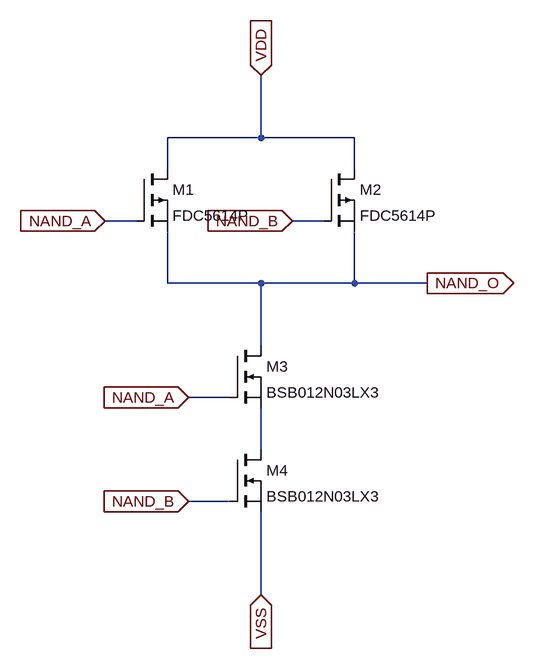
[diagram p0: schematic m_Nand.asc]
m_Nand.asc, the LTspice schematic file:
Version 4
SHEET 1 880 680
WIRE 192 -336 192 -432
WIRE 192 -336 48 -336
WIRE 336 -336 192 -336
WIRE 48 -288 48 -336
WIRE 336 -288 336 -336
WIRE 0 -208 -48 -208
WIRE 288 -208 240 -208
WIRE 48 -112 48 -192
WIRE 192 -112 48 -112
WIRE 336 -112 336 -192
WIRE 336 -112 192 -112
WIRE 448 -112 336 -112
WIRE 192 -16 192 -112
WIRE 144 64 80 64
WIRE 192 144 192 80
WIRE 144 224 80 224
WIRE 192 368 192 240
FLAG 192 -432 VDD
IOPIN 192 -432 In
FLAG 192 368 VSS
IOPIN 192 368 In
FLAG -48 -208 NAND_A
IOPIN -48 -208 In
FLAG 448 -112 NAND_O
IOPIN 448 -112 Out
FLAG 240 -208 NAND_B
IOPIN 240 -208 In
FLAG 80 64 NAND_A
IOPIN 80 64 In
FLAG 80 224 NAND_B
IOPIN 80 224 In
SYMBOL pmos 0 -288 R0
SYMATTR InstName M1
SYMATTR Value FDC5614P
SYMBOL pmos 288 -288 R0
SYMATTR InstName M2
SYMATTR Value FDC5614P
SYMBOL nmos 144 -16 R0
SYMATTR InstName M3
SYMATTR Value BSB012N03LX3
SYMBOL nmos 144 144 R0
SYMATTR InstName M4
SYMATTR Value BSB012N03LX3

The netlist it stands for:
* m_Nand.asc
M1 VDD NAND_A NAND_O NAND_O FDC5614P
M2 VDD NAND_B NAND_O NAND_O FDC5614P
M3 NAND_O NAND_A N001 N001 BSB012N03LX3
M4 N001 NAND_B VSS VSS BSB012N03LX3
.model NMOS NMOS
.model PMOS PMOS
.lib standard.mos
.backanno
.end